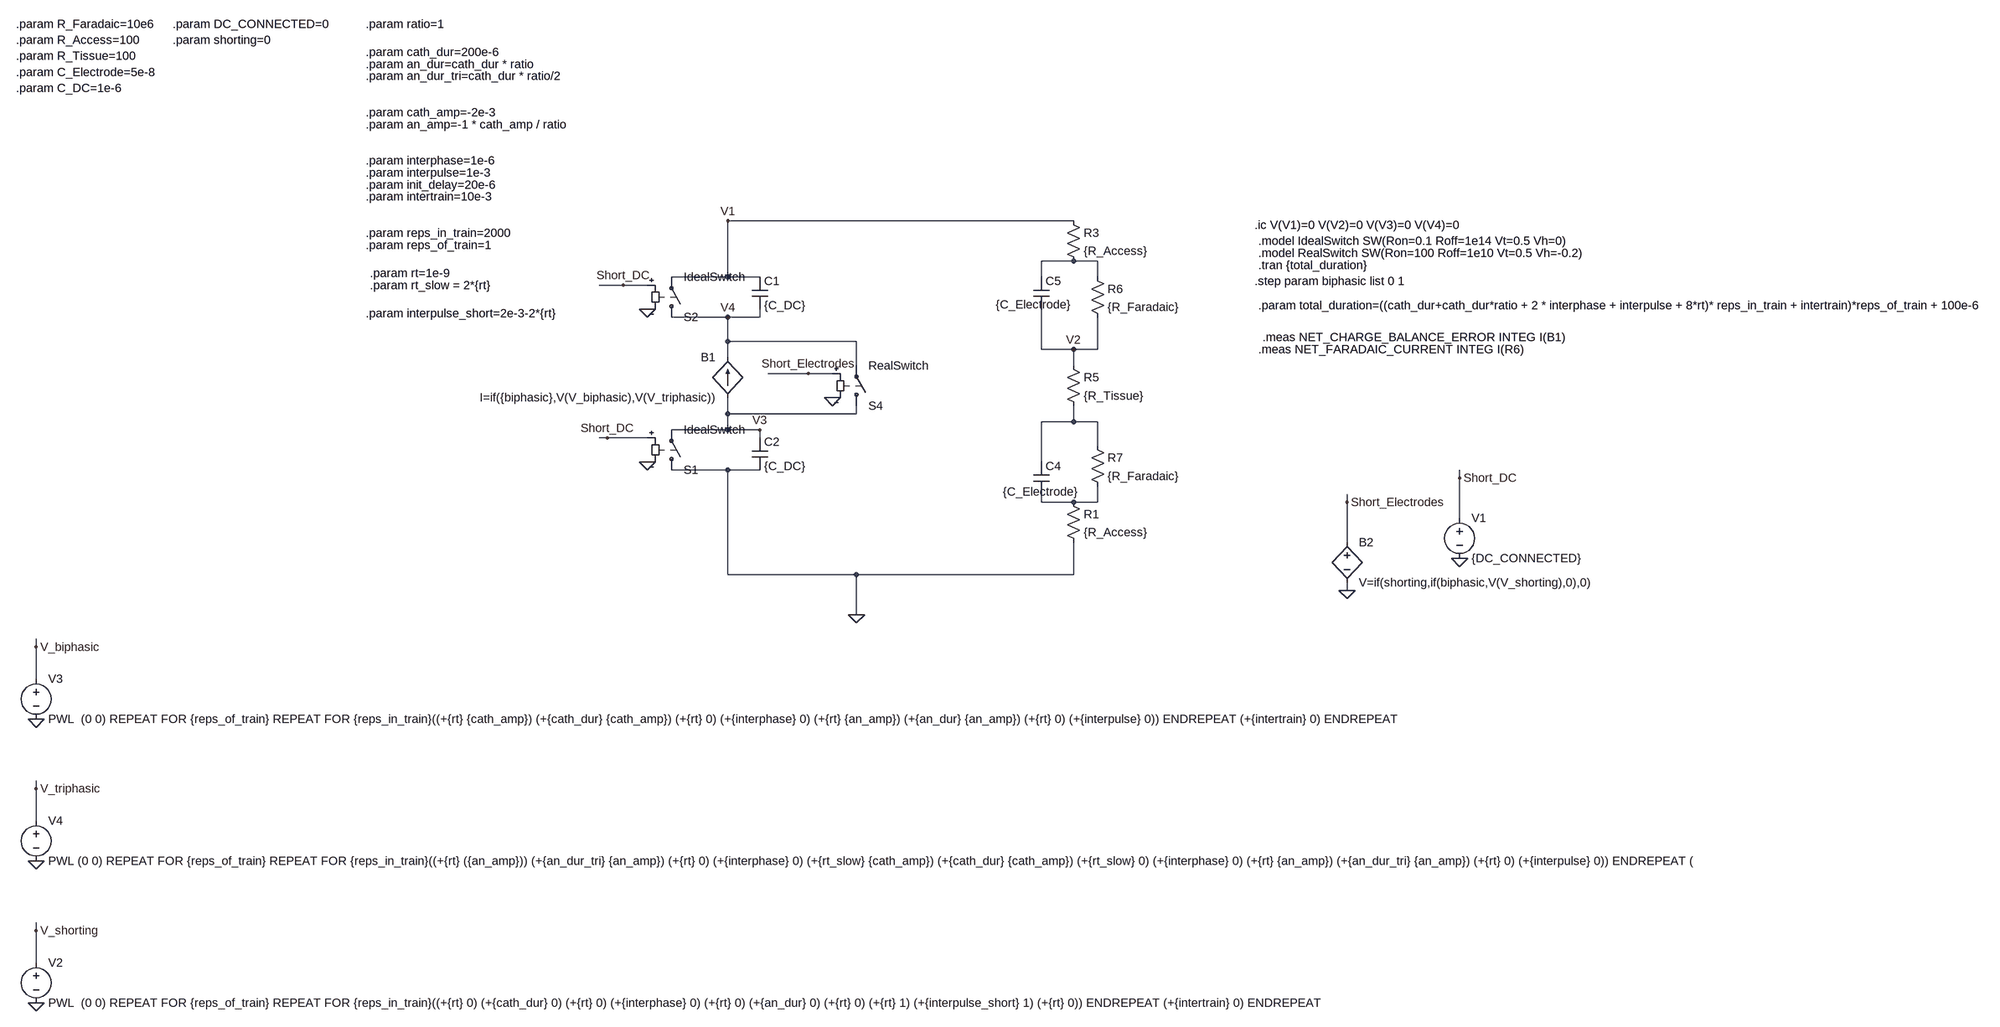
[diagram p0: schematic Full.asc]
Full.asc, the LTspice schematic file:
Version 4
SHEET 1 2592 1220
WIRE 720 -400 32 -400
WIRE 720 -320 656 -320
WIRE 768 -320 720 -320
WIRE 32 -288 32 -400
WIRE 32 -288 -80 -288
WIRE 96 -288 32 -288
WIRE 656 -288 656 -320
WIRE 768 -288 768 -320
WIRE -176 -272 -224 -272
WIRE -128 -272 -176 -272
WIRE 32 -208 -80 -208
WIRE 96 -208 96 -224
WIRE 96 -208 32 -208
WIRE 32 -160 32 -208
WIRE 288 -160 32 -160
WIRE 656 -144 656 -224
WIRE 720 -144 656 -144
WIRE 768 -144 768 -208
WIRE 768 -144 720 -144
WIRE 32 -128 32 -160
WIRE 288 -112 288 -160
WIRE 720 -112 720 -144
WIRE 192 -96 112 -96
WIRE 240 -96 192 -96
WIRE 32 -16 32 -48
WIRE 288 -16 288 -32
WIRE 288 -16 32 -16
WIRE 720 0 720 -32
WIRE 720 0 656 0
WIRE 768 0 720 0
WIRE 32 16 32 -16
WIRE 32 16 -80 16
WIRE 96 16 32 16
WIRE -208 32 -224 32
WIRE -128 32 -208 32
WIRE 96 32 96 16
WIRE 768 48 768 0
WIRE 656 80 656 0
WIRE 32 96 -80 96
WIRE 96 96 32 96
WIRE 1488 112 1488 96
WIRE 656 160 656 144
WIRE 720 160 656 160
WIRE 768 160 768 128
WIRE 768 160 720 160
WIRE 1264 160 1264 144
WIRE 1488 192 1488 112
WIRE 1264 240 1264 160
WIRE 32 304 32 96
WIRE 288 304 32 304
WIRE 720 304 720 240
WIRE 720 304 288 304
WIRE 1264 336 1264 320
WIRE 288 384 288 304
WIRE -1344 448 -1344 432
WIRE -1344 512 -1344 448
WIRE -1344 752 -1344 736
WIRE -1344 816 -1344 752
WIRE -1344 1056 -1344 1040
WIRE -1344 1120 -1344 1056
FLAG 288 384 0
FLAG 32 -400 V1
FLAG 32 -208 V4
FLAG 720 -144 V2
FLAG 96 16 V3
FLAG 240 -48 0
FLAG -128 80 0
FLAG -128 -224 0
FLAG -176 -272 Short_DC
FLAG -208 32 Short_DC
FLAG 1488 112 Short_DC
FLAG 1488 272 0
FLAG 1264 160 Short_Electrodes
FLAG 1264 336 0
FLAG 192 -96 Short_Electrodes
FLAG -1344 592 0
FLAG -1344 448 V_biphasic
FLAG -1344 896 0
FLAG -1344 752 V_triphasic
FLAG -1344 1200 0
FLAG -1344 1056 V_shorting
SYMBOL cap 80 32 R0
SYMATTR InstName C2
SYMATTR Value {C_DC}
SYMBOL cap 640 80 R0
WINDOW 3 -61 59 Left 2
SYMATTR Value {C_Electrode}
SYMATTR InstName C4
SYMBOL cap 80 -288 R0
SYMATTR InstName C1
SYMATTR Value {C_DC}
SYMBOL cap 640 -288 R0
WINDOW 3 -75 55 Left 2
SYMATTR Value {C_Electrode}
SYMATTR InstName C5
SYMBOL res 704 144 R0
SYMATTR InstName R1
SYMATTR Value {R_Access}
SYMBOL res 704 -416 R0
SYMATTR InstName R3
SYMATTR Value {R_Access}
SYMBOL res 704 -128 R0
SYMATTR InstName R5
SYMATTR Value {R_Tissue}
SYMBOL sw -80 112 M180
SYMATTR InstName S1
SYMATTR Value IdealSwitch
SYMBOL sw -80 -192 M180
SYMATTR InstName S2
SYMATTR Value IdealSwitch
SYMBOL sw 288 -16 M180
SYMATTR InstName S4
SYMATTR Value RealSwitch
SYMBOL res 752 -304 R0
SYMATTR InstName R6
SYMATTR Value {R_Faradaic}
SYMBOL res 752 32 R0
SYMATTR InstName R7
SYMATTR Value {R_Faradaic}
SYMBOL voltage 1488 176 R0
WINDOW 123 0 0 Left 2
WINDOW 39 0 0 Left 2
SYMATTR InstName V1
SYMATTR Value {DC_CONNECTED}
SYMBOL voltage -1344 496 R0
WINDOW 123 0 0 Left 2
WINDOW 39 0 0 Left 2
SYMATTR InstName V3
SYMATTR Value PWL  (0 0) REPEAT FOR {reps_of_train} REPEAT FOR {reps_in_train}((+{rt} {cath_amp}) (+{cath_dur} {cath_amp}) (+{rt} 0) (+{interphase} 0) (+{rt} {an_amp}) (+{an_dur} {an_amp}) (+{rt} 0) (+{interpulse} 0)) ENDREPEAT (+{intertrain} 0) ENDREPEAT
SYMBOL bi 32 -48 R180
WINDOW 0 24 80 Left 2
WINDOW 3 24 0 Left 2
SYMATTR InstName B1
SYMATTR Value I=if({biphasic},V(V_biphasic),V(V_triphasic))
SYMBOL voltage -1344 800 R0
WINDOW 123 0 0 Left 2
WINDOW 39 0 0 Left 2
SYMATTR InstName V4
SYMATTR Value PWL (0 0) REPEAT FOR {reps_of_train} REPEAT FOR {reps_in_train}((+{rt} ({an_amp})) (+{an_dur_tri} {an_amp}) (+{rt} 0) (+{interphase} 0) (+{rt_slow} {cath_amp}) (+{cath_dur} {cath_amp}) (+{rt_slow} 0) (+{interphase} 0) (+{rt} {an_amp}) (+{an_dur_tri} {an_amp}) (+{rt} 0) (+{interpulse} 0)) ENDREPEAT (+{intertrain} 0) ENDREPEAT
SYMBOL bv 1264 224 R0
SYMATTR InstName B2
SYMATTR Value V=if(shorting,if(biphasic,V(V_shorting),0),0)
SYMBOL voltage -1344 1104 R0
WINDOW 123 0 0 Left 2
WINDOW 39 0 0 Left 2
SYMATTR InstName V2
SYMATTR Value PWL  (0 0) REPEAT FOR {reps_of_train} REPEAT FOR {reps_in_train}((+{rt} 0) (+{cath_dur} 0) (+{rt} 0) (+{interphase} 0) (+{rt} 0) (+{an_dur} 0) (+{rt} 0) (+{rt} 1) (+{interpulse_short} 1) (+{rt} 0)) ENDREPEAT (+{intertrain} 0) ENDREPEAT
TEXT 1080 -392 Left 2 !.ic V(V1)=0 V(V2)=0 V(V3)=0 V(V4)=0
TEXT -1072 -792 Left 2 !.param DC_CONNECTED=0
TEXT 1088 -360 Left 2 !.model IdealSwitch SW(Ron=0.1 Roff=1e14 Vt=0.5 Vh=0)
TEXT -680 -296 Left 2 !.param rt=1e-9
TEXT -688 -736 Left 2 !.param cath_dur=200e-6
TEXT -688 -792 Left 2 !.param ratio=1
TEXT -688 -520 Left 2 !.param interphase=1e-6
TEXT -688 -496 Left 2 !.param interpulse=1e-3
TEXT -688 -472 Left 2 !.param init_delay=20e-6
TEXT -1384 -792 Left 2 !.param R_Faradaic=10e6
TEXT -1384 -760 Left 2 !.param R_Access=100
TEXT -1384 -728 Left 2 !.param R_Tissue=100
TEXT -1384 -696 Left 2 !.param C_Electrode=5e-8
TEXT -688 -616 Left 2 !.param cath_amp=-2e-3
TEXT 1088 -312 Left 2 !.tran {total_duration}
TEXT -1384 -664 Left 2 !.param C_DC=1e-6
TEXT -688 -712 Left 2 !.param an_dur=cath_dur * ratio
TEXT -688 -592 Left 2 !.param an_amp=-1 * cath_amp / ratio
TEXT -688 -376 Left 2 !.param reps_in_train=2000
TEXT -688 -448 Left 2 !.param intertrain=10e-3
TEXT -688 -352 Left 2 !.param reps_of_train=1
TEXT 1080 -280 Left 2 !.step param biphasic list 0 1
TEXT -688 -688 Left 2 !.param an_dur_tri=cath_dur * ratio/2
TEXT 1088 -144 Left 2 !.meas NET_FARADAIC_CURRENT INTEG I(R6)
TEXT -1072 -760 Left 2 !.param shorting=0
TEXT 1088 -336 Left 2 !.model RealSwitch SW(Ron=100 Roff=1e10 Vt=0.5 Vh=-0.2)
TEXT 1088 -232 Left 2 !.param total_duration=((cath_dur+cath_dur*ratio + 2 * interphase + interpulse + 8*rt)* reps_in_train + intertrain)*reps_of_train + 100e-6
TEXT -680 -272 Left 2 !.param rt_slow = 2*{rt}
TEXT -688 -216 Left 2 !.param interpulse_short=2e-3-2*{rt}
TEXT 1096 -168 Left 2 !.meas NET_CHARGE_BALANCE_ERROR INTEG I(B1)

The netlist it stands for:
* Full.asc
C2 V3 0 {C_DC}
C4 N002 N003 {C_Electrode}
C1 V1 V4 {C_DC}
C5 N001 V2 {C_Electrode}
R1 N003 0 {R_Access}
R3 V1 N001 {R_Access}
R5 V2 N002 {R_Tissue}
S1 0 V3 Short_DC 0 IdealSwitch
S2 V4 V1 Short_DC 0 IdealSwitch
S4 V3 V4 Short_Electrodes 0 RealSwitch
R6 N001 V2 {R_Faradaic}
R7 N002 N003 {R_Faradaic}
V1 Short_DC 0 {DC_CONNECTED}
V3 V_biphasic 0 PWL  (0 0) REPEAT FOR {reps_of_train} REPEAT FOR {reps_in_train}((+{rt} {cath_amp}) (+{cath_dur} {cath_amp}) (+{rt} 0) (+{interphase} 0) (+{rt} {an_amp}) (+{an_dur} {an_amp}) (+{rt} 0) (+{interpulse} 0)) ENDREPEAT (+{intertrain} 0) ENDREPEAT
B1 V3 V4 I=if({biphasic},V(V_biphasic),V(V_triphasic))
V4 V_triphasic 0 PWL (0 0) REPEAT FOR {reps_of_train} REPEAT FOR {reps_in_train}((+{rt} ({an_amp})) (+{an_dur_tri} {an_amp}) (+{rt} 0) (+{interphase} 0) (+{rt_slow} {cath_amp}) (+{cath_dur} {cath_amp}) (+{rt_slow} 0) (+{interphase} 0) (+{rt} {an_amp}) (+{an_dur_tri} {an_amp}) (+{rt} 0) (+{interpulse} 0)) ENDREPEAT (+{intertrain} 0) ENDREPEAT
B2 Short_Electrodes 0 V=if(shorting,if(biphasic,V(V_shorting),0),0)
V2 V_shorting 0 PWL  (0 0) REPEAT FOR {reps_of_train} REPEAT FOR {reps_in_train}((+{rt} 0) (+{cath_dur} 0) (+{rt} 0) (+{interphase} 0) (+{rt} 0) (+{an_dur} 0) (+{rt} 0) (+{rt} 1) (+{interpulse_short} 1) (+{rt} 0)) ENDREPEAT (+{intertrain} 0) ENDREPEAT
.ic V(V1)=0 V(V2)=0 V(V3)=0 V(V4)=0
.param DC_CONNECTED=0
.model IdealSwitch SW(Ron=0.1 Roff=1e14 Vt=0.5 Vh=0)
.param rt=1e-9
.param cath_dur=200e-6
.param ratio=1
.param interphase=1e-6
.param interpulse=1e-3
.param init_delay=20e-6
.param R_Faradaic=10e6
.param R_Access=100
.param R_Tissue=100
.param C_Electrode=5e-8
.param cath_amp=-2e-3
.tran {total_duration}
.param C_DC=1e-6
.param an_dur=cath_dur * ratio
.param an_amp=-1 * cath_amp / ratio
.param reps_in_train=2000
.param intertrain=10e-3
.param reps_of_train=1
.step param biphasic list 0 1
.param an_dur_tri=cath_dur * ratio/2
.meas NET_FARADAIC_CURRENT INTEG I(R6)
.param shorting=0
.model RealSwitch SW(Ron=100 Roff=1e10 Vt=0.5 Vh=-0.2)
.param total_duration=((cath_dur+cath_dur*ratio + 2 * interphase + interpulse + 8*rt)* reps_in_train + intertrain)*reps_of_train + 100e-6
.param rt_slow = 2*{rt}
.param interpulse_short=2e-3-2*{rt}
.meas NET_CHARGE_BALANCE_ERROR INTEG I(B1)
.backanno
.end